# EasyEDA Pro project foc电动螺丝刀.eprj, board PCB1_2
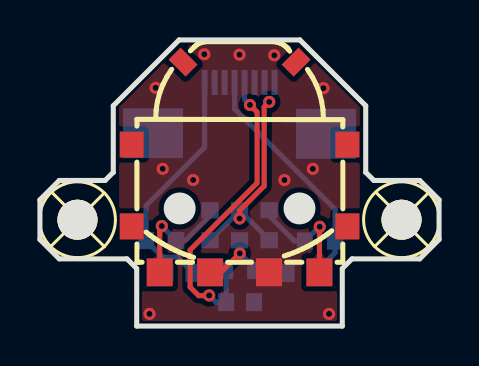
[diagram p5: board, top side]
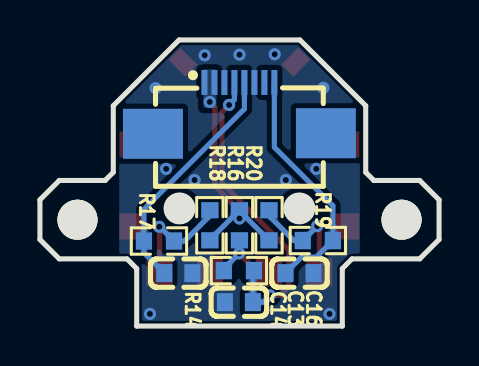
[diagram p6: board, bottom side, seen from below]

Outline 19.98 x 14.33 mm; copper layers: Top Layer, Inner1, Inner2, Bottom Layer. Coordinates in mm from the lower left corner of the outline.
Outline path: 0,6.32 0.97,7.29 3.26,7.29 3.67,7.7 3.67,11.03 6.97,14.33 13.02,14.33 16.31,11.03 16.31,7.7 16.72,7.29 19.02,7.29 19.98,6.32 19.98,4.33 19.02,3.37 15.63,3.37 15.14,2.88 15.14,0 4.84,0 4.84,2.88 4.36,3.37 0.97,3.37 0,4.33 0,6.32
Stack: Top Layer 0.035mm 外层铜厚1oz / Dielectric1 0.2104mm 7628 RC49% 8.6mil / Inner1 0.0152mm 内层铜厚 / Dielectric2 1.065mm 1.1mm H/HOZ Copper / Inner2 0.0152mm 内层铜厚 / Dielectric3 0.2104mm 7628 RC49% 8.6mil / Bottom Layer 0.035mm 外层铜厚1oz

## Design rules (mm)
template: 自定义配置1
spacing copperThickness1oz (default): track to track 0.102, other pairs 0.152 to 0.3
spacing copperThickness2oz: track to track 0.203, other pairs 0.152 to 0.3
track width copperThickness1oz (default): min 0.127, default 0.254, max 2.54
track width copperThickness2oz: min 0.203, default 0.406, max 2.54
track width trackWidth1: min 0.254, default 0.762, max 2.54
differential pair differentialPair (default): width min 0.127, default 0.254, max 2.54; gap min 0.152, default 0.152
via viaSize (default): diameter min 0.5, default 0.61, max 10; hole min 0.3, default 0.305, max 6.299
net GND uses copperRegionAll, copperThickness2oz
net +3V3_PL uses copperRegionAll

## Placement (name value [footprint] x y rotation side)
C13  100nF  [C0603]  10.02 1.2 180 bottom
C14  100nF  [C0603]  13.06 2.65 0 bottom
C16  100nF  [C0603]  6.99 2.65 0 bottom
FPC3  FPC-05F-8PH20  [FPC-SMD_8P-P0.50_FPC-05F-8PH20]  10 10.91 180 bottom
R14  10K  [R0603]  10.02 2.78 180 bottom
R16  10K  [R0603]  10 5.05 90 bottom
R17  10K  [R0603]  14.02 4.26 0 bottom
R18  10K  [R0603]  11.47 5.05 270 bottom
R19  10K  [R0603]  6.07 4.28 180 bottom
R20  10K  [R0603]  8.52 5.05 270 bottom
SCREW3  -  [M2螺丝]  18.1 5.33 0 top
SCREW4  -  [M2螺丝]  1.88 5.33 0 top
U7  SIQ-02FVS3_1  [SW-SMD_SIQ-02FVS3_1]  10 7.96 0 top

## Footprints (pads in the part's own frame, mm; a bottom-side part is the same pattern mirrored in y, then rotated)
C0603
  rect 0.8x0.9 smd: 1(-0.7,0) 2(0.7,0)
FPC-SMD_8P-P0.50_FPC-05F-8PH20
  rect 0.3x1.25 smd: 1(-1.75,1.288) 2(-1.25,1.288) 3(-0.75,1.288) 4(-0.25,1.288) 5(0.25,1.288) 6(0.75,1.288) 7(1.25,1.288) 8(1.75,1.288)
  rect 3x2.5 smd: 9(4.33,-1.258) 10(-4.33,-1.282)
M2螺丝
  round 2 hole 2: 1(0,0)
R0603
  rect 0.806x0.864 smd: 1(-0.753,0) 2(0.753,0)
SW-SMD_SIQ-02FVS3_1
  rect 1.2x1.3 smd: 0(-5.4,1.136) 0(-5.4,-2.964) 0(5.4,1.136) 0(5.4,-2.964)
  rect 0.85x1.2 smd rot 45: 0(-2.829,5.264)
  rect 0.85x1.2 smd rot 135: 0(2.829,5.264)
  rect 1.3x1.4 smd: A(-4,-5.264) B(4,-5.264) C(1.475,-5.264) S(-1.475,-5.264)

## Nets
+3V3_PL: FPC3.1 FPC3.2 R16.2 R18.2 R20.2
GND: C13.1 C14.1 C16.1 FPC3.3 FPC3.6 U7.C
E_A/SPI_MISO_PL: C16.2 FPC3.8 R19.2
E_B/SPI_CS_PL: C14.2 FPC3.5 R17.2
E_PUSH_PL: C13.2 FPC3.4 R14.2
PWR/SPI_SCK_PL: FPC3.7
$1N1931: R19.1 R20.1 U7.A
$1N1933: R17.1 R18.1 U7.B
$1N1934: R14.1 R16.1 U7.S

Pads without a net: FPC3 9 10; SCREW3 1; SCREW4 1; U7 0

## Via types
v1: diameter 0.61, hole 0.305, Top Layer to Bottom Layer, 18 vias

## Routing (per net, layer and track width the routed paths; a pad name or vN(x,y) marks a point on that pad's centre or on a via; arc(x,y) is an arc through that point)
+3V3_PL: length 10.7
  Top Layer w0.254: v1(10,5.39) 10,5.78 11.23,7.01 11.23,10.97 v1(11.48,11.23)
  Bottom Layer w0.254: R20.2 10,5.77 R16.2 11.47,4.32 R18.2
GND:
  vias: v1(5.49,0.61) v1(5.8,11.93) v1(6.15,7.87) v1(7.67,7.31) v1(8.23,13.61) v1(9.99,13.59) v1(11.74,13.56) v1(12.24,7.31) v1(13.66,7.87) v1(14.2,11.91) v1(14.48,0.61)
E_A/SPI_MISO_PL: length 12.2
  Bottom Layer w0.254: 7.69,2.65 6.89,3.45 6.15,3.45 R19.2 5.32,6.03 8.25,8.96 FPC3.8
E_B/SPI_CS_PL: length 12.1
  Bottom Layer w0.254: C14.2 14.78,3.67 R17.2 14.78,5.85 9.75,10.88 FPC3.5
E_PUSH_PL: length 15.6
  Top Layer w0.254: v1(10.52,11.07) 10.87,10.72 10.87,7.16 7.52,3.81 7.52,1.95 7.95,1.52 8.46,1.52 v1(8.47,1.53)
  Bottom Layer w0.254: R14.2 9.32,2.73 C13.2 8.81,1.2 v1(8.47,1.53) ; FPC3.4 10.25,11.34 v1(10.52,11.07)
$1N1931: length 5.9
  Top Layer w0.254: v1(6.1,5.01) 6,4.9 U7.A
  Bottom Layer w0.254: R20.1 8.52,5.53 7.28,4.28 R19.1 6.1,5 v1(6.1,5.01)
$1N1933: length 5.9
  Top Layer w0.254: v1(14.01,4.97) 14,4.96 U7.B
  Bottom Layer w0.254: v1(14.01,4.97) 13.98,4.97 R17.1 12.74,4.26 11.47,5.53 R18.1
$1N1934: length 3.1
  Top Layer w0.254: v1(10.01,3.64) 9.06,2.69 8.52,2.69
  Bottom Layer w0.254: R14.1 10.78,2.88 v1(10.01,3.64)

## Copper pours and planes (outline as drawn; the poured copper is in the pictures)
+3V3_PL on Bottom Layer: 11.15,12.86 11.81,12.86 11.81,10.92 11.15,10.92
GND on Top Layer: 3.96,14.32 16.02,14.32 16.02,0.25 3.96,0.25
GND on Bottom Layer: 3.96,14.32 16.02,14.32 16.02,0.25 3.96,0.25

Small or netless copper shapes (teardrops, artwork), in the pictures only: 9 on Top Layer, 30 on Bottom Layer
